# Altium schematic sheet codec.SchDoc
size A4
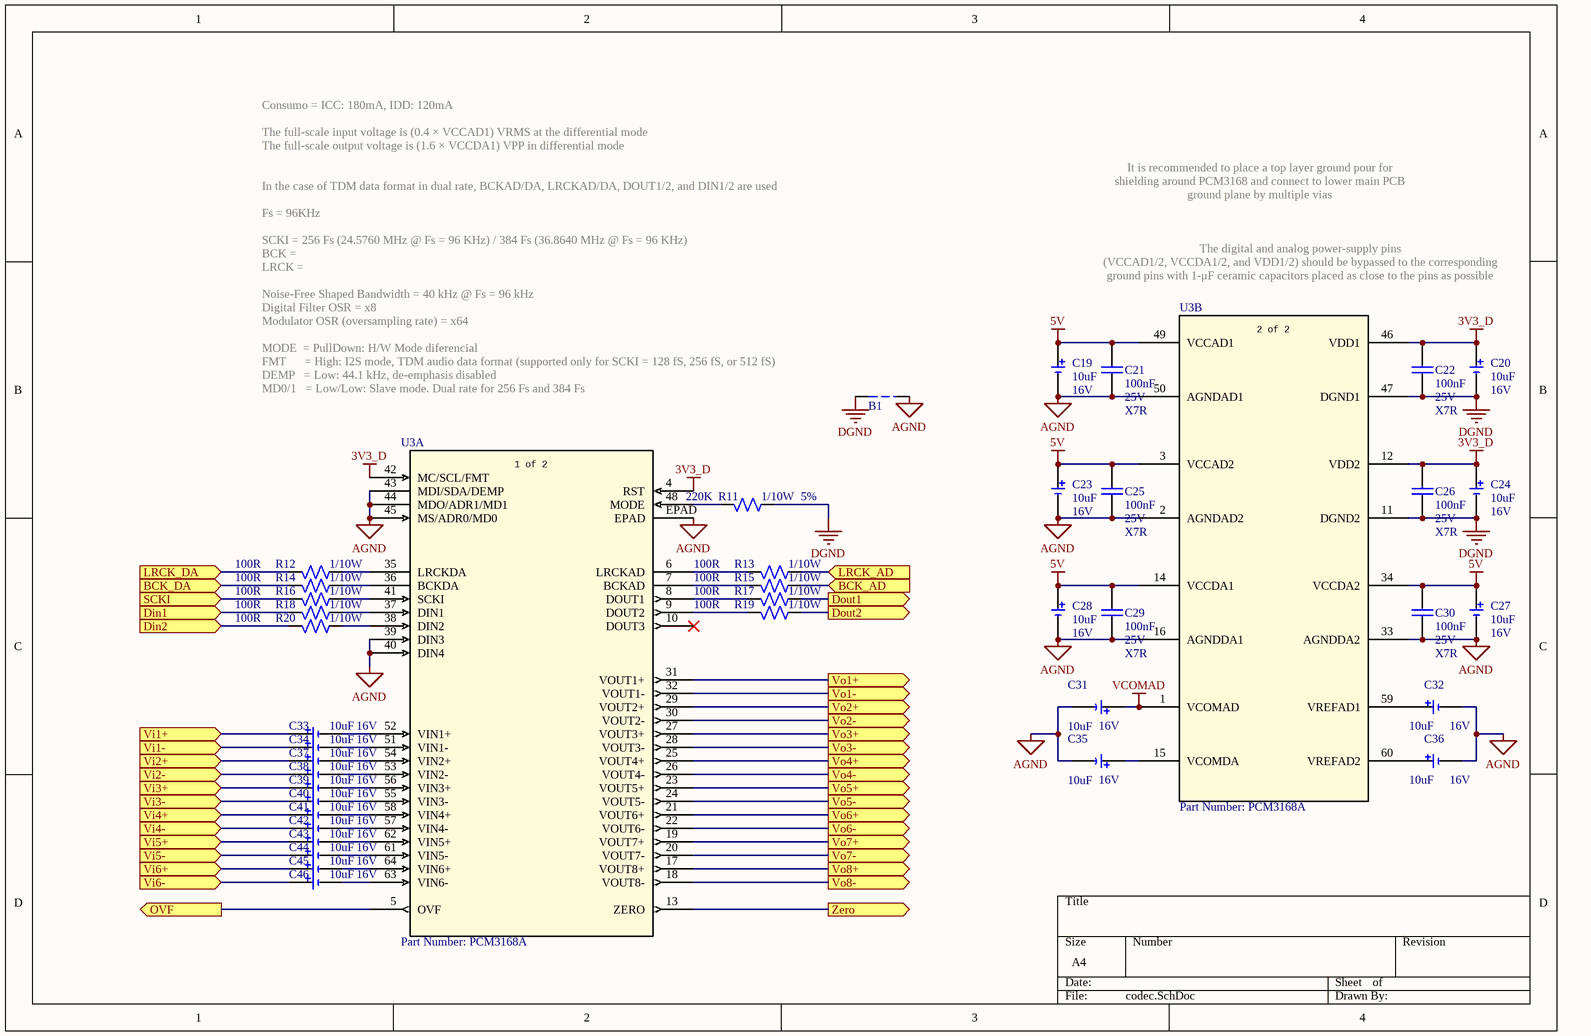
[diagram p0: codec.SchDoc]

## Parts
B1  GND_BIND  [Track_8mil]  (value not drawn)
C19  Valor: 10uF  tension: 16V  [CAP_Electrolytic]  (hidden comment: Capacitor polarizado)
C20  Valor: 10uF  tension: 16V  [CAP_Electrolytic]  (hidden comment: Capacitor polarizado)
C21  valor: 100nF  tension: 25V  tolerancia: X7R  [C0805]  (hidden comment: Capacitor)
C22  valor: 100nF  tension: 25V  tolerancia: X7R  [C0805]  (hidden comment: Capacitor)
C23  Valor: 10uF  tension: 16V  [CAP_Electrolytic]  (hidden comment: Capacitor polarizado)
C24  Valor: 10uF  tension: 16V  [CAP_Electrolytic]  (hidden comment: Capacitor polarizado)
C25  valor: 100nF  tension: 25V  tolerancia: X7R  [C0805]  (hidden comment: Capacitor)
C26  valor: 100nF  tension: 25V  tolerancia: X7R  [C0805]  (hidden comment: Capacitor)
C27  Valor: 10uF  tension: 16V  [CAP_Electrolytic]  (hidden comment: Capacitor polarizado)
C28  Valor: 10uF  tension: 16V  [CAP_Electrolytic]  (hidden comment: Capacitor polarizado)
C29  valor: 100nF  tension: 25V  tolerancia: X7R  [C0805]  (hidden comment: Capacitor)
C30  valor: 100nF  tension: 25V  tolerancia: X7R  [C0805]  (hidden comment: Capacitor)
C31  Valor: 10uF  tension: 16V  [CAP_Electrolytic]  (hidden comment: Capacitor polarizado)
C32  Valor: 10uF  tension: 16V  [CAP_Electrolytic]  (hidden comment: Capacitor polarizado)
C33  Valor: 10uF  tension: 16V  [CAP_Electrolytic]  (hidden comment: Capacitor polarizado)
C34  Valor: 10uF  tension: 16V  [CAP_Electrolytic]  (hidden comment: Capacitor polarizado)
C35  Valor: 10uF  tension: 16V  [CAP_Electrolytic]  (hidden comment: Capacitor polarizado)
C36  Valor: 10uF  tension: 16V  [CAP_Electrolytic]  (hidden comment: Capacitor polarizado)
C37  Valor: 10uF  tension: 16V  [CAP_Electrolytic]  (hidden comment: Capacitor polarizado)
C38  Valor: 10uF  tension: 16V  [CAP_Electrolytic]  (hidden comment: Capacitor polarizado)
C39  Valor: 10uF  tension: 16V  [CAP_Electrolytic]  (hidden comment: Capacitor polarizado)
C40  Valor: 10uF  tension: 16V  [CAP_Electrolytic]  (hidden comment: Capacitor polarizado)
C41  Valor: 10uF  tension: 16V  [CAP_Electrolytic]  (hidden comment: Capacitor polarizado)
C42  Valor: 10uF  tension: 16V  [CAP_Electrolytic]  (hidden comment: Capacitor polarizado)
C43  Valor: 10uF  tension: 16V  [CAP_Electrolytic]  (hidden comment: Capacitor polarizado)
C44  Valor: 10uF  tension: 16V  [CAP_Electrolytic]  (hidden comment: Capacitor polarizado)
C45  Valor: 10uF  tension: 16V  [CAP_Electrolytic]  (hidden comment: Capacitor polarizado)
C46  Valor: 10uF  tension: 16V  [CAP_Electrolytic]  (hidden comment: Capacitor polarizado)
R11  Valor: 220K  Potencia: 1/10W  Tolerancia: 5%  [R0805]  (hidden comment: Resistor)
R12  Valor: 100R  Potencia: 1/10W  [R0805]  (hidden comment: Resistor)
R13  Valor: 100R  Potencia: 1/10W  [R0805]  (hidden comment: Resistor)
R14  Valor: 100R  Potencia: 1/10W  [R0805]  (hidden comment: Resistor)
R15  Valor: 100R  Potencia: 1/10W  [R0805]  (hidden comment: Resistor)
R16  Valor: 100R  Potencia: 1/10W  [R0805]  (hidden comment: Resistor)
R17  Valor: 100R  Potencia: 1/10W  [R0805]  (hidden comment: Resistor)
R18  Valor: 100R  Potencia: 1/10W  [R0805]  (hidden comment: Resistor)
R19  Valor: 100R  Potencia: 1/10W  [R0805]  (hidden comment: Resistor)
R20  Valor: 100R  Potencia: 1/10W  [R0805]  (hidden comment: Resistor)
U3  Part Number: PCM3168A  [PAP64_7X7P26]  (parts A,B of 2)

## Ports
BCK_AD (in), BCK_DA (in), Din1 (in), Din2 (in), Dout1 (out), Dout2 (out), LRCK_AD (in), LRCK_DA (in), OVF (out), SCKI (in), Vi1+ (in), Vi1- (in), Vi2+ (in), Vi2- (in), Vi3+ (in), Vi3- (in), Vi4+ (in), Vi4- (in), Vi5+ (in), Vi5- (in), Vi6+ (in), Vi6- (in), Vo1+ (out), Vo1- (out), Vo2+ (out), Vo2- (out), Vo3+ (out), Vo3- (out), Vo4+ (out), Vo4- (out), Vo5+ (out), Vo5- (out), Vo6+ (out), Vo6- (out), Vo7+ (out), Vo7- (out), Vo8+ (out), Vo8- (out), Zero (out)

## Nets
3V3_D: C20.1 C22.1 C24.1 C26.1 U3.4(RST) U3.12(VDD2) U3.42(MC/SCL/FMT) U3.46(VDD1)
5V: C19.1 C21.1 C23.1 C25.1 C27.1 C28.1 C29.1 C30.1 U3.3(VCCAD2) U3.14(VCCDA1) U3.34(VCCDA2) U3.49(VCCAD1)
AGND: B1.1 C19.2 C21.2 C23.2 C25.2 C27.2 C28.2 C29.2 C30.2 C31.2 C32.2 C35.2 C36.2 U3.2(AGNDAD2) U3.16(AGNDDA1) U3.33(AGNDDA2) U3.39(DIN3) U3.40(DIN4) U3.43(MDI/SDA/DEMP) U3.44(MDO/ADR1/MD1) U3.45(MS/ADR0/MD0) U3.50(AGNDAD1) U3.EPAD
DGND: B1.2 C20.2 C22.2 C24.2 C26.2 R11.1 U3.11(DGND2) U3.47(DGND1)
VCOMAD: C31.1 U3.1(VCOMAD)
BCK_AD: R15.1 ; port BCK_AD
BCK_DA: R14.2 ; port BCK_DA
Din1: R18.2 ; port Din1
Din2: R20.2 ; port Din2
Dout1: R17.1 ; port Dout1
Dout2: R19.1 ; port Dout2
LRCK_AD: R13.1 ; port LRCK_AD
LRCK_DA: R12.2 ; port LRCK_DA
OVF: U3.5(OVF) ; port OVF
SCKI: R16.2 ; port SCKI
Vi1+: C33.1 ; port Vi1+
Vi1-: C34.1 ; port Vi1-
Vi2+: C37.1 ; port Vi2+
Vi2-: C38.1 ; port Vi2-
Vi3+: C39.1 ; port Vi3+
Vi3-: C40.1 ; port Vi3-
Vi4+: C41.1 ; port Vi4+
Vi4-: C42.1 ; port Vi4-
Vi5+: C43.1 ; port Vi5+
Vi5-: C44.1 ; port Vi5-
Vi6+: C45.1 ; port Vi6+
Vi6-: C46.1 ; port Vi6-
Vo1+: U3.31(VOUT1+) ; port Vo1+
Vo1-: U3.32(VOUT1-) ; port Vo1-
Vo2+: U3.29(VOUT2+) ; port Vo2+
Vo2-: U3.30(VOUT2-) ; port Vo2-
Vo3+: U3.27(VOUT3+) ; port Vo3+
Vo3-: U3.28(VOUT3-) ; port Vo3-
Vo4+: U3.25(VOUT4+) ; port Vo4+
Vo4-: U3.26(VOUT4-) ; port Vo4-
Vo5+: U3.23(VOUT5+) ; port Vo5+
Vo5-: U3.24(VOUT5-) ; port Vo5-
Vo6+: U3.21(VOUT6+) ; port Vo6+
Vo6-: U3.22(VOUT6-) ; port Vo6-
Vo7+: U3.19(VOUT7+) ; port Vo7+
Vo7-: U3.20(VOUT7-) ; port Vo7-
Vo8+: U3.17(VOUT8+) ; port Vo8+
Vo8-: U3.18(VOUT8-) ; port Vo8-
Zero: U3.13(ZERO) ; port Zero
NetC32_1: C32.1 U3.59(VREFAD1)
NetC33_2: C33.2 U3.52(VIN1+)
NetC34_2: C34.2 U3.51(VIN1-)
NetC35_1: C35.1 U3.15(VCOMDA)
NetC36_1: C36.1 U3.60(VREFAD2)
NetC37_2: C37.2 U3.54(VIN2+)
NetC38_2: C38.2 U3.53(VIN2-)
NetC39_2: C39.2 U3.56(VIN3+)
NetC40_2: C40.2 U3.55(VIN3-)
NetC41_2: C41.2 U3.58(VIN4+)
NetC42_2: C42.2 U3.57(VIN4-)
NetC43_2: C43.2 U3.62(VIN5+)
NetC44_2: C44.2 U3.61(VIN5-)
NetC45_2: C45.2 U3.64(VIN6+)
NetC46_2: C46.2 U3.63(VIN6-)
NetR11_2: R11.2 U3.48(MODE)
NetR12_1: R12.1 U3.35(LRCKDA)
NetR13_2: R13.2 U3.6(LRCKAD)
NetR14_1: R14.1 U3.36(BCKDA)
NetR15_2: R15.2 U3.7(BCKAD)
NetR16_1: R16.1 U3.41(SCKI)
NetR17_2: R17.2 U3.8(DOUT1)
NetR18_1: R18.1 U3.37(DIN1)
NetR19_2: R19.2 U3.9(DOUT2)
NetR20_1: R20.1 U3.38(DIN2)

Not connected (* = marked no-connect by the designer): U3 10(DOUT3)*

## Notes on the sheet
- Consumo = ICC: 180mA, IDD: 120mA
- The full-scale output voltage is (1.6 × VCCDA1) VPP in differential mode
- The full-scale input voltage is (0.4 × VCCAD1) VRMS at the differential mode
- It is recommended to place a top layer ground pour for
- shielding around PCM3168 and connect to lower main PCB
- SCKI = 256 Fs (24.5760 MHz @ Fs = 96 KHz) / 384 Fs (36.8640 MHz @ Fs = 96 KHz)
- Fs = 96KHz
- In the case of TDM data format in dual rate, BCKAD/DA, LRCKAD/DA, DOUT1/2, and DIN1/2 are used
- ground plane by multiple vias
- The digital and analog power-supply pins
- Noise-Free Shaped Bandwidth = 40 kHz @ Fs = 96 kHz
- Digital Filter OSR = x8
- BCK =
- LRCK =
- (VCCAD1/2, VCCDA1/2, and VDD1/2) should be bypassed to the corresponding
- ground pins with 1-μF ceramic capacitors placed as close to the pins as possible
- MODE  = PullDown: H/W Mode diferencial
- DEMP   = Low: 44.1 kHz, de-emphasis disabled
- (near B1) FMT      = High: I2S mode, TDM audio data format (supported only for SCKI = 128 fS, 256 fS, or 512 fS)
- Modulator OSR (oversampling rate) = x64
- MD0/1   = Low/Low: Slave mode. Dual rate for 256 Fs and 384 Fs
- (in symbol PCM3168A-Q1_PAP_, part A) 1 of 2
- (in symbol PCM3168A-Q1_PAP_, part B) 2 of 2

## Library data of the parts
B1 = GND_BIND: Conecta distintos planos de masa por una pista
C21 C22 C25 C26 C29 C30 = Capacitor: Capacitor de placas paralelas; Encapsulado: 0805
R11-R20 = Resistor: Resistencia
U3 = PCM3168A-Q1_PAP_: Manufacturer: Texas Instruments; Manufacturer_Part_Number: PCM3168A-Q1_PAP_64; Vendor: Texas Instruments; Cod. Proveedor: *; Encapsulado: *; Link: *; Proveedor: *
C19 C20 C23 C24 C27 C28 C31-C46 = Capacitor polarizado: Link: *; Fabricante: *